# Altium schematic sheet AFE Shield.SchDoc
size A; SheetNumber: 2; SheetTotal: 4
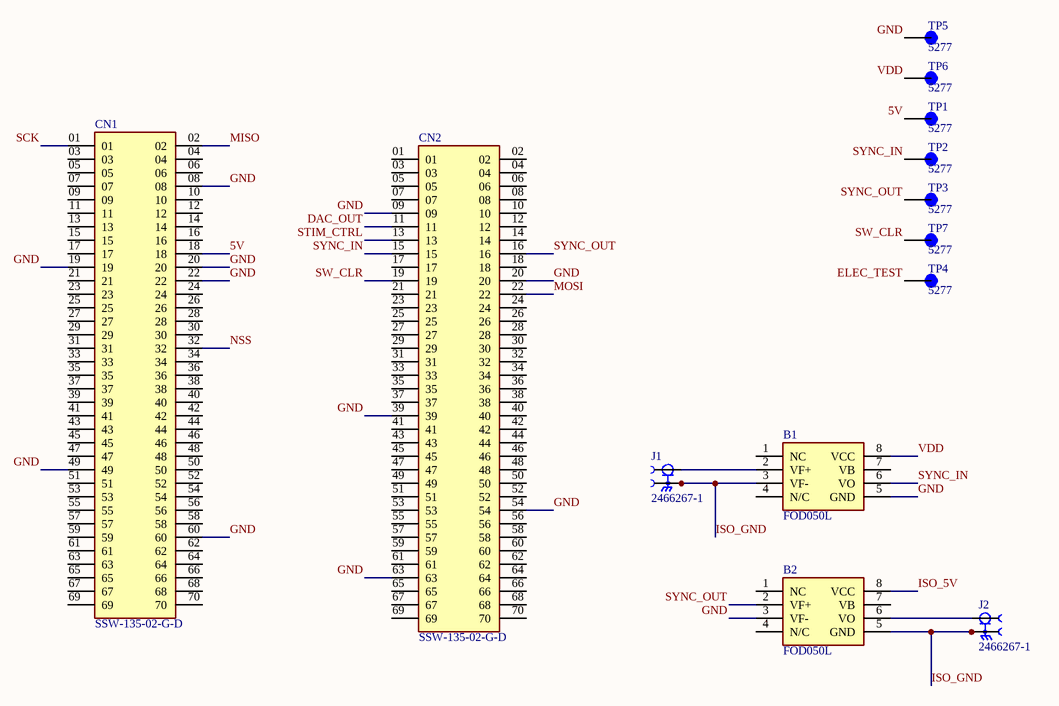
[diagram p0: AFE Shield.SchDoc]

## Parts
B1  FOD050L  [SOIC127P594X363-8N]
B2  FOD050L  [SOIC127P594X363-8N]
CN1  SSW-135-02-G-D  [SAMTEC_SSW-135-02-G-D]
CN2  SSW-135-02-G-D  [SAMTEC_SSW-135-02-G-D]
J1  2466267-1  [TE_2466267-1]
J2  2466267-1  [TE_2466267-1]
TP1  5277  [KEYSTONE_5277]
TP2  5277  [KEYSTONE_5277]
TP3  5277  [KEYSTONE_5277]
TP4  5277  [KEYSTONE_5277]
TP5  5277  [KEYSTONE_5277]
TP6  5277  [KEYSTONE_5277]
TP7  5277  [KEYSTONE_5277]

## Nets
5V: CN1.18 TP1.1(TP)
DAC_OUT: CN2.11
ELEC_TEST: TP4.1(TP)
GND: B1.5(GND) B2.3(VF-) CN1.08 CN1.19 CN1.20 CN1.22 CN1.49 CN1.60 CN2.09 CN2.20 CN2.39 CN2.54 CN2.63 TP5.1(TP)
ISO_5V: B2.8(VCC)
ISO_GND: B1.3(VF-) B2.5(GND) J1.2(SH) J1.3(SH) J1.4(SH) J1.5(SH) J2.2(SH) J2.3(SH) J2.4(SH) J2.5(SH)
MISO: CN1.02
MOSI: CN2.22
NSS: CN1.32
SCK: CN1.01
STIM_CTRL: CN2.13
SW_CLR: CN2.19 TP7.1(TP)
SYNC_IN: B1.6(VO) CN2.15 TP2.1(TP)
SYNC_OUT: B2.2(VF+) CN2.16 TP3.1(TP)
VDD: B1.8(VCC) TP6.1(TP)
NetB1_2: B1.2(VF+) J1.1(SIG)
NetB2_6: B2.6(VO) J2.1(SIG)

Not connected (* = marked no-connect by the designer): B1 1(NC) 4(N/C) 7(VB); B2 1(NC) 4(N/C) 7(VB); CN1 03 04 05 06 07 09 10 11 12 13 14 15 16 17 21 23 24 25 26 27 28 29 30 31 33 34 35 36 37 38 39 40 41 42 43 44 45 46 47 48 50 51 52 53 54 55 56 57 58 59 61 62 63 64 65 66 67 68 69 70; CN2 01 02 03 04 05 06 07 08 10 12 14 17 18 21 23 24 25 26 27 28 29 30 31 32 33 34 35 36 37 38 40 41 42 43 44 45 46 47 48 49 50 51 52 53 55 56 57 58 59 60 61 62 64 65 66 67 68 69 70

## Library data of the parts
B1 B2 = CMP-047-000000-2: DIN-EN/IEC60747-5-5, 565 V Peak Working Insulation Voltage; Safety and Regulatory Approvals:; UL1577, 2,500 VACRMS for 1 Minute; Available in Single-channel 8-pin SOIC (FOD050L) or Dual-channel 8-pin SOIC (FOD053L);; Manufacturer_Name: onsemi; Geometry.Height: 3.63mm; Mouser Part Number: 512-FOD050L; Source: FOD050L.SchLib; Mouser Price/Stock: https://www.mouser.co.uk/ProductDetail/onsemi-Fairchild/FOD050L?qs=ReZUMDdiXnRPjBKyX9bkKw%3D%3D; Design Item ID: FOD050L; Arrow Price/Stock: https://www.arrow.com/en/products/fod050l/on-semiconductor?region=nac; Arrow Part Number: FOD050L; Datasheet Link: https://www.onsemi.com/pub/Collateral/FOD053L-D.PDF; Manufacturer_Part_Number: FOD050L
CN1 CN2 = CMP-066-000000-6: 70-pin connector; MF: Samtec; Source: SSW-135-02-G-D.SchLib; Availability: Unavailable; Price: None; Pin Count: 70; MP: SSW-135-02-G-D; Design Item ID: SSW-135-02-G-D; Package: None; Value: *; Component Type: Standard
J1 J2 = CMP-019-000000-2: BNC connector; Source: 2466267-1.SchLib; MP: 2466267-1; Package: None; Price: None; Component Type: Standard; Availability: Unavailable; Pin Count: 5; Design Item ID: 2466267-1; Value: *
TP1-TP7 = CMP-080-000000-2: TEST POINT (BLUE) - COMPACT; MF: Keystone Electronics; Check_prices: https://www.snapeda.com/parts/5277/Keystone/view-part/?ref=eda; Pin Count: 1; Source: 5277.SchLib; SnapEDA_Link: https://www.snapeda.com/parts/5277/Keystone/view-part/?ref=snap; Package: None; MP: 5277; Component Type: Standard; Value: *; Design Item ID: 5277